# Altium project PCB_Project_PowerLord.PrjPcb (part 1 of 2)
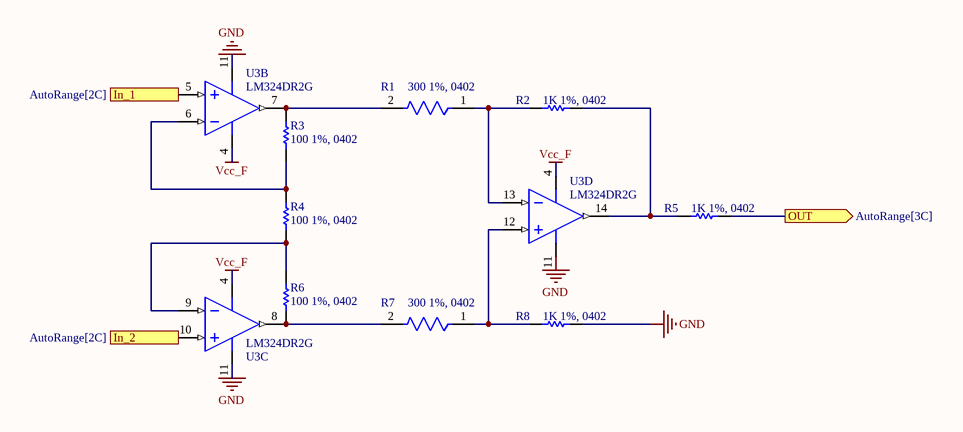
[diagram p0: DiffAmp_K-10.SchDoc]
11 sheets, 126 parts. Net scope: hierarchical (ports join the sheet entries above them; power ports are global).
Board file: PowerModule.PcbDoc
Sheets:
  DiffAmp_K-10.SchDoc
  PowerModule.SchDoc
    PowerModuleCell_M1 = PowerModuleCell.SchDoc
      Temp = TempSensor.SchDoc
  CellVoltageControl.SchDoc
    SellSensor = DiffAmp_K-0.2.SchDoc
  MainBoard.SchDoc
    CurrentSence = MainShunt.SchDoc
    Voltmetr = WideRangeVoltmeter.SchDoc
  UI.SchDoc
  Componets.SchDoc

## Sheet DiffAmp_K-10.SchDoc
size A4; SheetNumber: 5; SheetTotal: 7

### Parts
(Parts that share a designator on the sheet are numbered #1, #2 ... from top to bottom, then left to right.)
R1#1  300 1%, 0402  [FP-ERJ2RK-IPC_A]
R2#1  1K 1%, 0402  [RESC1005X40X25NL05T05]
R3#1  100 1%, 0402  [RESC1005X40X25LL05T05]
R4#1  100 1%, 0402  [RESC1005X40X25LL05T05]
R5#1  1K 1%, 0402  [RESC1005X40X25NL05T05]
R6#1  100 1%, 0402  [RESC1005X40X25LL05T05]
R7#1  300 1%, 0402  [FP-ERJ2RK-IPC_A]
R8#1  1K 1%, 0402  [RESC1005X40X25NL05T05]
U3  LM324DR2G  [ONSC-SOIC-14-751A-03_V]  (parts B,C,D of 4)

### Ports
In_1 (in, see AutoRange[2C]), In_2 (in, see AutoRange[2C]), OUT (out, see AutoRange[3C])

### Nets
GND: R8#1.2 U3.11(VEE/GND)  [project net Shunt_L]
Vcc_F: U3.4(VCC)
NetR1#1_1: R1#1.1 R2#1.1 U3.13(IN4-)
NetR1#1_2: R1#1.2 R3#1.2 U3.7(OUT2)
NetR2#1_2: R2#1.2 R5#1.1 U3.14(OUT4)
NetR3#1_1: R3#1.1 R4#1.2 U3.6(IN2-)
NetR4#1_1: R4#1.1 R6#1.2 U3.9(IN3-)
NetR5#1_2: R5#1.2 ; port OUT
NetR6#1_1: R6#1.1 R7#1.2 U3.8(OUT3)
NetR7#1_1: R7#1.1 R8#1.1 U3.12(IN4+)
NetU3_5: U3.5(IN2+) ; port In_1
NetU3_10: U3.10(IN3+) ; port In_2

### Notes on the sheet
- Labels drawn without touching a wire or pin: GND

### Library data of the parts
R1#1 R7#1 = CMP-1011-00449-3: RES SMD 300 OHM 1% 1/10W 0402; Power Rating: 100mW; Voltage Rating: 50V; Temperature Coefficient: 100ppm/°C; Resistance: 300R; Case Code (Imperial): 0402; Termination: SMD/SMT; REACH SVHC: No SVHC; Number of Terminations: 2; Composition: Thick Film; Case Code (Metric): 1005; Voltage Rating (DC): 50V; Packaging: Tape and Reel; Max Power Dissipation: 100mW; Tolerance: 1%; Lead Free: Lead Free; Military Standard: Not; Mount: Surface Mount; Height: 0.35mm; Package Quantity: 10000; Max Operating Temperature: 155°C; Depth: 0.5mm; Min Operating Temperature: -55°C; Length: 1mm; Contact Plating: Tin; Width: 0.02inch; Case/Package: 0402
R2#1 R5#1 R8#1 = CMP-1011-00510-4: Chip Resistor, 1 KOhm, +/- 1%, 100 mW, -55 to 155 degC, 0402 (1005 Metric), RoHS, Tape and Reel; PartNumber: ERJ-2RKF1001X; Manufacturer: Basic Passives; Voltage Rating: 50 V; Case\/Package: 0402; Resistance: 1 KOhm; Power Rating: 100 mW; DatasheetVersion: 04/2015; Radiation Hardening: No; Pins: 2; Height: 0.35 mm; RoHSCompliant: true; Case Code (Imperial): 0402; ComponentLink2Description: Datasheet; ComponentLink1Description: Manufacturer URL; PackageReference: 0402; Mount: Surface Mount; Package Quantity: 10000; Tolerance: 1%; ComponentLink1URL: http://www.panasonic.com/; PackageDescription: 2-Pin Surface Mount Device, Body 1 x 0.5 mm; Mounting Technology: Surface Mount; Case Code (Metric): 1005; ComponentLink2URL: http://industrial.panasonic.com/cdbs/www-data/pdf/RDA0000/AOA0000C86.pdf; REACH SVHC: Yes; Packaging: Tape and Reel; Max Operating Temperature: 155 degC; Min Operating Temperature: -55 degC; Width: 0.5 mm; Length: 1 mm
R3#1 R4#1 R6#1 = CMP-2002-00605-3: Chip Resistor, 100 Ohm, +/- 1%, 100 mW, -55 to 155 degC, 0402 (1005 Metric), RoHS, Tape and Reel; Manufacturer: Basic Passives; PartNumber: ERJ-2RKF1000X; Power Rating: 100 mW; Resistance: 100 Ohm; Voltage Rating: 50 V; Case\/Package: 0402; Width: 0.5 mm; Pins: 2; ComponentLink2Description: Datasheet; PackageReference: 0402; Height: 0.35 mm; Tolerance: 1%; DatasheetVersion: 04/2015; Case Code (Imperial): 0402; Min Operating Temperature: -55 degC; Radiation Hardening: No; Length: 1 mm; Package Quantity: 10000; PackageDescription: 2-Pin Surface Mount Device, Body 1 x 0.5 mm; Mounting Technology: Surface Mount; Case Code (Metric): 1005; Packaging: Tape and Reel; ComponentLink1URL: http://www.panasonic.com/; RoHSCompliant: true; Max Operating Temperature: 155 degC; REACH SVHC: Yes; ComponentLink1Description: Manufacturer URL; ComponentLink2URL: http://industrial.panasonic.com/cdbs/www-data/pdf/RDA0000/AOA0000C86.pdf; Mount: Surface Mount
U3 = CMP-1310-00171-1: Single Supply Quad Operational Amplifier, 3 to 32 V, 0 to 70 degC, 14-Pin SOIC, Pb-Free, Tape and Reel; Manufacturer: On Semiconductor; VCC Max (V): 32; VCC Min (V): 3; PackageVersion: Rev. K, 05/2011; ComponentLink3URL: http://www.onsemi.com/pub_link/Collateral/751A-03.PDF; ComponentLink3Description: Package Specification; Packing: Tape and Reel; ComponentLink2URL: http://www.onsemi.cn/pub_link/Collateral/LM324-D.PDF; PackageReference: SOIC-14-751A-03; ComponentLink1URL: http://www.onsemi.com/; PackageDescription: 14-Pin Small Outline Integrated Circuit, Body 8.65 x 3.9 mm, Pitch 1.27 mm; ComponentLink1Description: Manufacturer URL; DatasheetVersion: Rev. 25; Mounting Technology: Surface Mount; RoHS: TRUE; ComponentLink2Description: Datasheet; PartNumber: LM324DR2G

## Sheet PowerModule.SchDoc
size A3; SheetNumber: 1; SheetTotal: 4
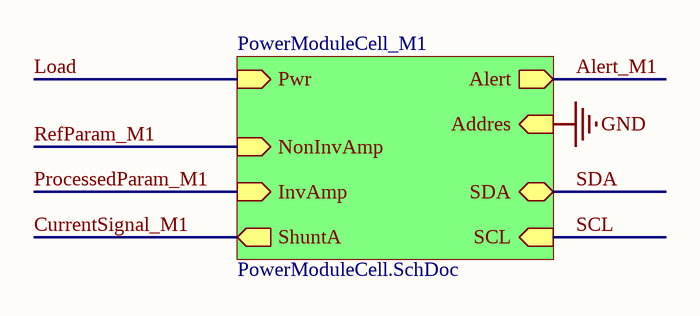
[diagram p1: PowerModule.SchDoc]

### Sub-sheets
PowerModuleCell_M1 = PowerModuleCell.SchDoc: Alert (out), Addres (in), SDA (bidir), SCL (in), Pwr (in), NonInvAmp (in), InvAmp (in), ShuntA (out)

### Nets
Alert_M1: sheet PowerModuleCell_M1/Alert

## Sheet PowerModuleCell.SchDoc
size A4; SheetNumber: 1; SheetTotal: 11
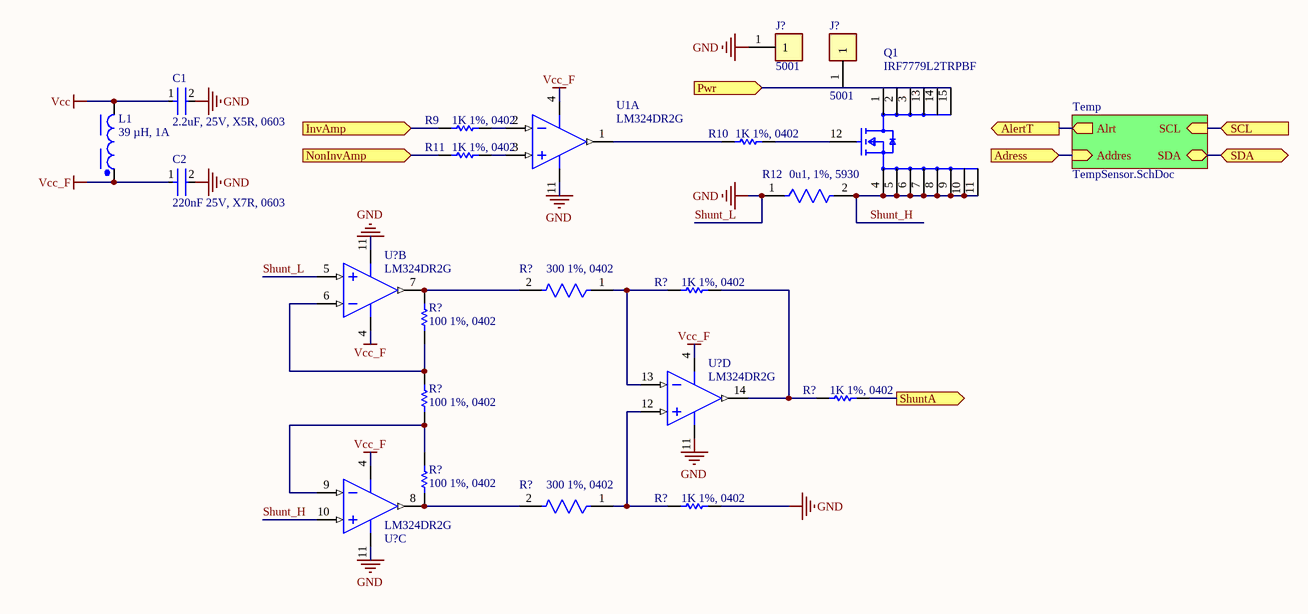
[diagram p2: PowerModuleCell.SchDoc]

### Parts
(Parts that share a designator on the sheet are numbered #1, #2 ... from top to bottom, then left to right.)
C1#1  2.2uF, 25V, X5R, 0603  [FP-GRM188-0_1-e0_2_0_5-MFG]
C2#1  220nF 25V, X7R, 0603  [FP-GCM188-0_1-IPC_B]
J?#1  5001  [FP-5001-MFG]  (no BOM)
J?#2  5001  [FP-5001-MFG]  (no BOM)
L1#1  39 µH, 1A  [WE-PD_7345]
Q1#1  IRF7779L2TRPBF  [FP-MG-WDSON-11-MFG]
R9#1  1K 1%, 0402  [RESC1005X40X25NL05T05]
R10#1  1K 1%, 0402  [RESC1005X40X25NL05T05]
R11#1  1K 1%, 0402  [RESC1005X40X25NL05T05]
R12#1  0u1, 1%, 5930  [FP-CSS2H-5930K-1L00F-MFG]
R?#1  300 1%, 0402  [FP-ERJ2RK-IPC_A]
R?#2  1K 1%, 0402  [RESC1005X40X25NL05T05]
R?#3  100 1%, 0402  [RESC1005X40X25LL05T05]
R?#4  1K 1%, 0402  [RESC1005X40X25NL05T05]
R?#5  100 1%, 0402  [RESC1005X40X25LL05T05]
R?#6  100 1%, 0402  [RESC1005X40X25LL05T05]
R?#7  300 1%, 0402  [FP-ERJ2RK-IPC_A]
R?#8  1K 1%, 0402  [RESC1005X40X25NL05T05]
U1#1  LM324DR2G  [ONSC-SOIC-14-751A-03_V]  (part A of 4)
U?#1  LM324DR2G  [ONSC-SOIC-14-751A-03_V]  (part B of 4)
U?#2  LM324DR2G  [ONSC-SOIC-14-751A-03_V]  (part D of 4)
U?#3  LM324DR2G  [ONSC-SOIC-14-751A-03_V]  (part C of 4)

### Sub-sheets
Temp = TempSensor.SchDoc: Alrt (out), SDA (bidir), SCL (in), Addres (in)

### Ports
Adress (in), AlertT (out), InvAmp (in, see PowerModule[5A]), NonInvAmp (in, see PowerModule[5A]), Pwr (in, see PowerModule[5A]), SCL (in, see PowerModule[6A], TempSensor[3C]), SDA (bidir, see PowerModule[6A], TempSensor[3C]), ShuntA (out, see PowerModule[5A])

### Nets
Shunt_L: C1#1.2 C2#1.2 J?#1.1 R12#1.1 R?#8.2 U1#1.11(VEE/GND) U?#1.5(IN2+) U?#1.11(VEE/GND) U?#3.11(VEE/GND)  [also labelled GND]
Vcc: C1#1.1 L1#1.2
Vcc_F: C2#1.1 L1#1.1 U1#1.4(VCC) U?#1.4(VCC) U?#2.4(VCC) U?#3.4(VCC)
CurrentSignal_M1: R?#4.2 ; port ShuntA
Load: J?#2.1 Q1#1.1(Drain) Q1#1.2(Drain) Q1#1.3(Drain) Q1#1.13(Drain) Q1#1.14(Drain) Q1#1.15(Drain) ; port Pwr
ProcessedParam_M1: R9#1.1 ; port InvAmp
RefParam_M1: R11#1.1 ; port NonInvAmp
SCL: port SCL, sheet Temp/SCL
SDA: port SDA, sheet Temp/SDA
Shunt_H: Q1#1.4(Source) Q1#1.5(Source) Q1#1.6(Source) Q1#1.7(Source) Q1#1.8(Source) Q1#1.9(Source) Q1#1.10(Source) Q1#1.11(Source) R12#1.2 U?#3.10(IN3+)
NetQ1#1_12: Q1#1.12(Gate) R10#1.2
NetR9#1_2: R9#1.2 U1#1.2(IN1-)
NetR10#1_1: R10#1.1 U1#1.1(OUT1)
NetR11#1_2: R11#1.2 U1#1.3(IN1+)
NetR15#1_1: port AlertT, sheet Temp/Alrt
NetR?#1_1: R?#1.1 R?#2.1 U?#2.13(IN4-)
NetR?#1_2: R?#1.2 R?#3.2 U?#1.7(OUT2)
NetR?#2_2: R?#2.2 R?#4.1 U?#2.14(OUT4)
NetR?#3_1: R?#3.1 R?#5.2 U?#1.6(IN2-)
NetR?#5_1: R?#5.1 R?#6.2 U?#3.9(IN3-)
NetR?#6_1: R?#6.1 R?#7.2 U?#3.8(OUT3)
NetR?#7_1: R?#7.1 R?#8.1 U?#2.12(IN4+)
NetU2#1_C1: port Adress, sheet Temp/Addres

Not connected (* = marked no-connect by the designer): U?#2 11(VEE/GND)

### Notes on the sheet
- Labels drawn without touching a wire or pin: GND

### Library data of the parts
C1#1 = CMP-2006-02820-2: Chip Multilayer Ceramic Capacitors for General Purpose, 0603, 2.2uF, X5R, 15%, 10%, 25V; Number of Pins: 2; Dielectric: X5R; Tolerance: 10%; Case Code (Imperial): 0603; Thickness: 0.035inch; Case/Package: 0603; Lead Free: Lead Free; Mount: Surface Mount; Material: Ceramic; Depth: 0.8mm; Voltage: 25V; Capacitance: 2.2uF; Min Operating Temperature: -55°C; Package Quantity: 4000; REACH SVHC: No SVHC; Resistor Type: Ceramic; Packaging: Tape and Reel; Case Code (Metric): 1608; Max Operating Temperature: 85°C; Width: 0.8mm; Termination: SMD/SMT; Voltage Rating: 25V; Length: 1.6mm; Voltage Rating (DC): 25V; Height: 0.8mm; Radiation Hardening: No; Weight: 0.000222oz
C2#1 = CMP-2006-02366-2: Ceramic Capacitor for Automotive 220nF  ±10% 25VDC X7R 0603 Paper T/R; Capacitance: 220nF; Mount: Surface Mount; Ratings: AEC-Q200; Case/Package: 0603; Packaging: Tape and Reel; Radiation Hardening: No; Voltage: 25V; Dielectric: X7R; Case Code (Imperial): 0603; Max Operating Temperature: 125°C; Min Operating Temperature: -55°C; Depth: 0.8mm; Termination: SMD/SMT; Package Quantity: 1; Case Code (Metric): 1608; Thickness: 0.035inch; Voltage Rating: 25V; Tolerance: 10%; Voltage Rating (DC): 25V; Height: 0.8mm; Lead Free: Lead Free; Length: 1.6mm; Width: 0.031inch
J?#1 J?#2 = CMP-2000-05181-2: PC TEST POINT MINIATURE BLACK; Body Material: Bronze; Plating: Silver; Inside Diameter: 1.27mm; Hole Diameter: 1.6mm; Number of Ports: 1; Outside Diameter: 2.54mm; Insulation: Insulated; Insulation Material: Nylon; Mount: Through Hole; RoHS Compliant: Yes; Series: THM; Height: 0.3inch; Termination: Through Hole; Material: Nylon; Packaging: Bulk; Contact Material: Bronze; REACH SVHC: No SVHC; Contact Plating: Silver; Orientation: Straight; Lead Free: Lead Free; Package Quantity: 100; Length: 7.62mm; Flammability Rating: UL94 V-0; Number of Contacts: 1; Diameter: 2.54mm; Housing Color: Black; Color: Black
L1#1 = CMP-0227-00153-2: NexarPartId: 29930417; Max DC Current: 1.11A; Shielding: Shielded; Inductance: 39µH; Self Resonant Frequency: 11MHz; DC Resistance (DCR): 145mΩ; Tolerance: 20%; Ambient Temperature Range Low: -40°C; Width: 7.3mm; Length: 7.3mm; Number of Pins: 2; Packaging: Tape & Reel; Height: 4.5mm; Ambient Temperature Range High: 85°C; Max Operating Temperature: 125°C; Depth: 7.3mm; Min Operating Temperature: -40°C; RoHS: Compliant; Current Rating: 1.11A
Q1#1 = CMP-32901-000937-1: MOSFET N-CH 150V 375A DIRECTFET; Drain to Source Resistance: 11mR; Power Dissipation: 125W; Turn-On Delay Time: 16ns; Threshold Voltage: 4V; Input Capacitance: 6.66nF; Turn-Off Delay Time: 36ns; Gate to Source Voltage (Vgs): 20V; Length: 0.36inch; Number of Pins: 11; Min Operating Temperature: -55°C; Halogen Free: Halogen Free; Rds On Max: 11mR; REACH SVHC: No SVHC; Max Operating Temperature: 175°C; Continuous Drain Current (ID): 375A; Max Power Dissipation: 125W; Mount: Surface Mount; Width: 0.28inch; Max Dual Supply Voltage: 150V; Lead Free: Lead Free; Height: 0.02inch; Series: HEXFET®; RoHS Compliant: Yes; Drain to Source Voltage (Vdss): 150V; Packaging: Cut Tape
R9#1 R10#1 R11#1 R?#2 R?#4 R?#8 = CMP-1011-00510-4: as R2#1 on sheet DiffAmp_K-10; DatasheetVersion: 04/2015; Radiation Hardening: No; Pins: 2; Height: 0.35 mm; RoHSCompliant: true; Case Code (Imperial): 0402; ComponentLink2Description: Datasheet; ComponentLink1Description: Manufacturer URL; PackageReference: 0402; Mount: Surface Mount; Package Quantity: 10000; Tolerance: 1%; ComponentLink1URL: http://www.panasonic.com/; PackageDescription: 2-Pin Surface Mount Device, Body 1 x 0.5 mm; Mounting Technology: Surface Mount; Case Code (Metric): 1005; ComponentLink2URL: http://industrial.panasonic.com/cdbs/www-data/pdf/RDA0000/AOA0000C86.pdf; REACH SVHC: Yes; Packaging: Tape and Reel; Max Operating Temperature: 155 degC; Min Operating Temperature: -55 degC; Width: 0.5 mm; Length: 1 mm
R12#1 = CMP-00059-73869598-1: CSS2H-5930K-1L00F Res Metal Strip 5930 0.001 Ohm 1% 9W ±50ppm/C Pad SMD Automotive T/R; Resistance: 1mΩ; Temperature Coefficient: 50ppm/°C; Case Code (Imperial): 5931; Width: 7.747mm; Min Operating Temperature: -55°C; Tolerance: 1%; Max Power Dissipation: 9W; Case Code (Metric): 1577; Max Operating Temperature: 170°C; NexarPartId: 73869598; Power Rating: 9W; Composition: Metal Element; Case/Package: 5930; Height: 939.8µm; Number of Terminations: 2; Schedule B: 8533210045, 8533210045; Packaging: Cut Tape; REACH SVHC: No SVHC; Features: Moisture Resistant; RoHS: Compliant; Length: 15.0114mm
R?#1 R?#7 = CMP-1011-00449-3: as R1#1 on sheet DiffAmp_K-10; Case Code (Imperial): 0402; Termination: SMD/SMT; REACH SVHC: No SVHC; Number of Terminations: 2; Composition: Thick Film; Case Code (Metric): 1005; Voltage Rating (DC): 50V; Packaging: Tape and Reel; Max Power Dissipation: 100mW; Tolerance: 1%; Lead Free: Lead Free; Military Standard: Not; Mount: Surface Mount; Height: 0.35mm; Package Quantity: 10000; Max Operating Temperature: 155°C; Depth: 0.5mm; Min Operating Temperature: -55°C; Length: 1mm; Contact Plating: Tin; Width: 0.02inch; Case/Package: 0402
R?#3 R?#5 R?#6 = CMP-2002-00605-3: as R3#1 on sheet DiffAmp_K-10; Width: 0.5 mm; Pins: 2; ComponentLink2Description: Datasheet; PackageReference: 0402; Height: 0.35 mm; Tolerance: 1%; DatasheetVersion: 04/2015; Case Code (Imperial): 0402; Min Operating Temperature: -55 degC; Radiation Hardening: No; Length: 1 mm; Package Quantity: 10000; PackageDescription: 2-Pin Surface Mount Device, Body 1 x 0.5 mm; Mounting Technology: Surface Mount; Case Code (Metric): 1005; Packaging: Tape and Reel; ComponentLink1URL: http://www.panasonic.com/; RoHSCompliant: true; Max Operating Temperature: 155 degC; REACH SVHC: Yes; ComponentLink1Description: Manufacturer URL; ComponentLink2URL: http://industrial.panasonic.com/cdbs/www-data/pdf/RDA0000/AOA0000C86.pdf; Mount: Surface Mount
U1#1 U?#1-U?#3 = CMP-1310-00171-1: as U3 on sheet DiffAmp_K-10; PackageVersion: Rev. K, 05/2011; ComponentLink3URL: http://www.onsemi.com/pub_link/Collateral/751A-03.PDF; ComponentLink3Description: Package Specification; Packing: Tape and Reel; ComponentLink2URL: http://www.onsemi.cn/pub_link/Collateral/LM324-D.PDF; PackageReference: SOIC-14-751A-03; ComponentLink1URL: http://www.onsemi.com/; PackageDescription: 14-Pin Small Outline Integrated Circuit, Body 8.65 x 3.9 mm, Pitch 1.27 mm; ComponentLink1Description: Manufacturer URL; DatasheetVersion: Rev. 25; Mounting Technology: Surface Mount; RoHS: TRUE; ComponentLink2Description: Datasheet; PartNumber: LM324DR2G

## Sheet TempSensor.SchDoc
size A4; SheetNumber: 3; SheetTotal: 10
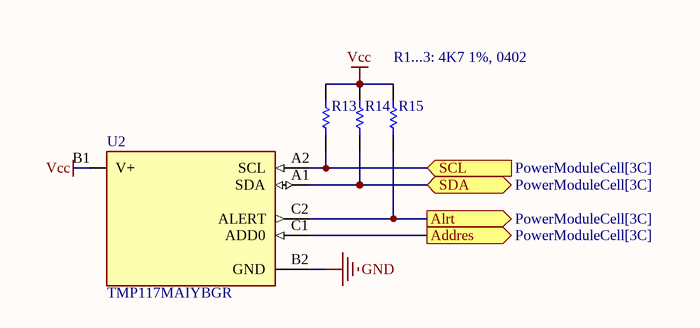
[diagram p3: TempSensor.SchDoc]

### Parts
(Parts that share a designator on the sheet are numbered #1, #2 ... from top to bottom, then left to right.)
R13#1  4K7 1%, 0402  [RESC1005X40X25LL05T05]  (value not drawn)
R14#1  4K7 1%, 0402  [RESC1005X40X25LL05T05]  (value not drawn)
R15#1  4K7 1%, 0402  [RESC1005X40X25LL05T05]  (value not drawn)
U2#1  TMP117MAIYBGR  [FP-YBG0006-MFG]

### Ports
Addres (out, see PowerModuleCell[3C]), Alrt (out, see PowerModuleCell[3C]), SCL (in, see PowerModuleCell[3C]), SDA (bidir, see PowerModuleCell[3C])

### Nets
GND: U2#1.B2(GND)  [project net Shunt_L]
Vcc: R13#1.2 R14#1.2 R15#1.2 U2#1.B1(V+)
SCL: R13#1.1 U2#1.A2(SCL) ; port SCL
SDA: R14#1.1 U2#1.A1(SDA) ; port SDA
NetR15#1_1: R15#1.1 U2#1.C2(ALERT) ; port Alrt
NetU2#1_C1: U2#1.C1(ADD0) ; port Addres

### Notes on the sheet
- R1...3: 4K7 1%, 0402

### Library data of the parts
R13#1 R14#1 R15#1 = CMP-2002-01154-4: Chip Resistor, 4.7 KOhm, +/- 1%, 0.1 W, -55 to 155 degC, 0402 (1005 Metric), RoHS, Tape and Reel; PartNumber: ERJ-2RKF4701X; Voltage Rating: 50 V; Case\/Package: 0402; Power Rating: 100 mW; Height: 0.35 mm; Mounting Technology: Surface Mount; REACH SVHC: Yes; Resistance: 4.7 KOhm; Max Operating Temperature: 155 degC; ComponentLink1Description: Manufacturer URL; ComponentLink2Description: Datasheet; Pins: 2; PackageReference: 0402; Tolerance: 1%; Case Code (Imperial): 0402; Length: 1 mm; PackageDescription: 2-Pin Surface Mount Device, Body 1 x 0.5 mm; RoHSCompliant: true; Package Quantity: 1; Radiation Hardening: No; DatasheetVersion: 04/2015; Width: 0.5 mm; Case Code (Metric): 1005; Mount: Surface Mount; ComponentLink1URL: http://www.panasonic.com/; Min Operating Temperature: -55 degC; Packaging: Cut Tape; ComponentLink2URL: http://industrial.panasonic.com/cdbs/www-data/pdf/RDA0000/AOA0000C86.pdf
U2#1 = CMP-04948-000037-1: TEMP SENSOR

## Sheet CellVoltageControl.SchDoc
size A4; SheetNumber: 1; SheetTotal: 7
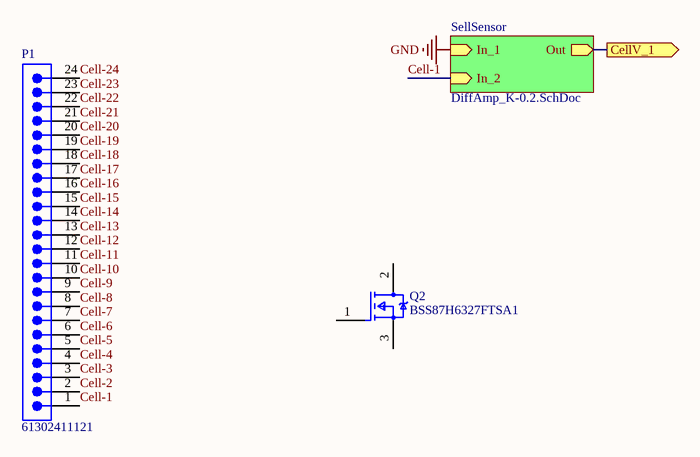
[diagram p4: CellVoltageControl.SchDoc]

### Parts
P1  61302411121  [61302411121]
Q2  BSS87H6327FTSA1  [FP-PG-SOT89-4-MFG]

### Sub-sheets
SellSensor = DiffAmp_K-0.2.SchDoc: Out (out), In_2 (in), In_1 (in)

### Ports
CellV_1 (out)

### Nets
Cell-1: P1.1 ; sheet SellSensor/In_2
Cell-2: P1.2
Cell-3: P1.3
Cell-4: P1.4
Cell-5: P1.5
Cell-6: P1.6
Cell-7: P1.7
Cell-8: P1.8
Cell-9: P1.9
Cell-10: P1.10
Cell-11: P1.11
Cell-12: P1.12
Cell-13: P1.13
Cell-14: P1.14
Cell-15: P1.15
Cell-16: P1.16
Cell-17: P1.17
Cell-18: P1.18
Cell-19: P1.19
Cell-20: P1.20
Cell-21: P1.21
Cell-22: P1.22
Cell-23: P1.23
Cell-24: P1.24
NetR30_2: port CellV_1, sheet SellSensor/Out

Not connected (* = marked no-connect by the designer): Q2 1(Gate) 2(Drain) 3(Source)

### Library data of the parts
P1 = CMP-1502-01109-3: NexarPartId: 32855561; Pitch: 2.54mm; Contact Resistance: 20mΩ; Operating Supply Voltage: 250V; Current Rating: 3A; Gender: Male; Connector Type: Male Pin; Number of Positions: 24; Packaging: Bulk; Lead Pitch: 2.54mm; Number of Pins: 24; Orientation: Vertical; Contact Material: Copper; REACH SVHC: Unknown; Color: Black; Mount: Through Hole; Contact Plating: Gold; Contact Mating Length: 5.9944mm; RoHS: Compliant; Termination: Solder; Number of Rows: 1; Number of Contacts: 24
Q2 = CMP-32901-001322-1: MOSFET N-CH 240V 260MA SOT89-4; Input Capacitance: 97pF; Drain to Source Resistance: 3.9R; Rise Time: 3.5ns; Rds On Max: 6R; Fall Time: 27.3ns; Turn-On Delay Time: 3.7ns; Number of Elements: 1; Power Dissipation: 1W; Element Configuration: Single; Gate to Source Voltage (Vgs): 20V; Polarity: N-CHANNEL; Turn-Off Delay Time: 17.6ns; Case/Package: SOT-89; Max Dual Supply Voltage: 240V; Drain to Source Voltage (Vdss): 240V; Lead Free: Lead Free; Package Quantity: 1000; Halogen Free: Not Halogen Free; RoHS Compliant: Yes; Width: 2.5mm; Length: 4.5mm; Mount: Surface Mount; Packaging: Tape and Reel; Max Power Dissipation: 1W; Height: 1.5mm; Max Operating Temperature: 150°C; Series: SIPMOS®; Drain to Source Breakdown Voltage: 240V; Min Operating Temperature: -55°C; Number of Pins: 3; Continuous Drain Current (ID): 260mA

## Sheet DiffAmp_K-0.2.SchDoc
size A3; SheetNumber: 3; SheetTotal: 7
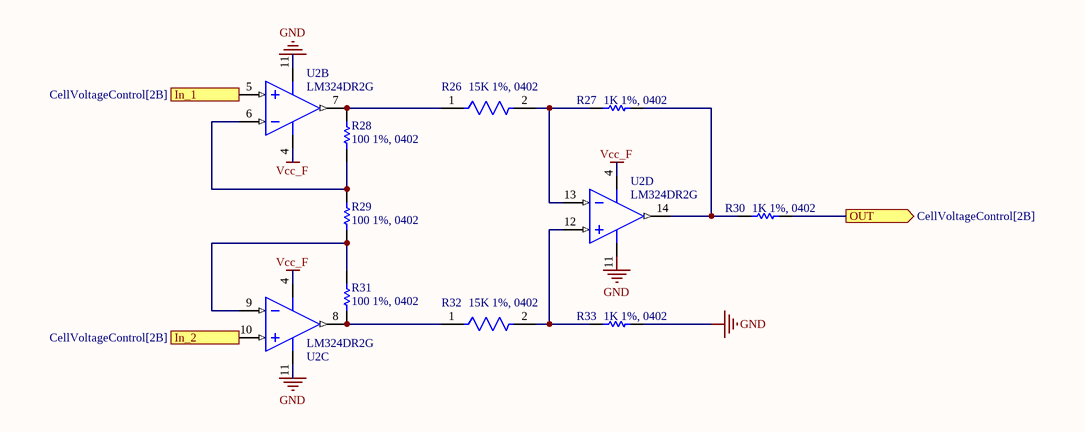
[diagram p5: DiffAmp_K-0.2.SchDoc]

### Parts
(Parts that share a designator on the sheet are numbered #1, #2 ... from top to bottom, then left to right.)
R26  15K 1%, 0402  [FP-ERJ2R-MFG]
R27  1K 1%, 0402  [RESC1005X40X25NL05T05]
R28  100 1%, 0402  [RESC1005X40X25LL05T05]
R29  100 1%, 0402  [RESC1005X40X25LL05T05]
R30  1K 1%, 0402  [RESC1005X40X25NL05T05]
R31  100 1%, 0402  [RESC1005X40X25LL05T05]
R32  15K 1%, 0402  [FP-ERJ2R-MFG]
R33  1K 1%, 0402  [RESC1005X40X25NL05T05]
U2#2  LM324DR2G  [ONSC-SOIC-14-751A-03_V]  (parts B,C,D of 4)

### Ports
In_1 (in, see CellVoltageControl[2B]), In_2 (in, see CellVoltageControl[2B]), OUT (out, see CellVoltageControl[2B])

### Nets
GND: R33.2 U2#2.5(IN2+) U2#2.11(VEE/GND) ; port In_1  [project net Shunt_L]
Vcc_F: U2#2.4(VCC)
Cell-1: U2#2.10(IN3+) ; port In_2
NetR26_1: R26.1 R28.2 U2#2.7(OUT2)
NetR26_2: R26.2 R27.1 U2#2.13(IN4-)
NetR27_2: R27.2 R30.1 U2#2.14(OUT4)
NetR28_1: R28.1 R29.2 U2#2.6(IN2-)
NetR29_1: R29.1 R31.2 U2#2.9(IN3-)
NetR30_2: R30.2 ; port OUT
NetR31_1: R31.1 R32.1 U2#2.8(OUT3)
NetR32_2: R32.2 R33.1 U2#2.12(IN4+)

### Notes on the sheet
- Labels drawn without touching a wire or pin: GND

### Library data of the parts
R26 R32 = CMP-2002-00694-4: RES SMD 15K OHM 1% 1/10W 0402; Manufacturer Part Number: ERJ-2RKF1502X; Manufacturer: Panasonic; Automotive Grade: Grade 0; Voltage Rating: 50V; Resistance: 15kΩ; Temperature Coefficient: 100ppm/°C; Power Rating: 0.1W; Value: 15kΩ; ComponentLink2URL: https://industrial.panasonic.com/cdbs/www-data/pdf/RDA0000/AOA0000C304.pdf; Automotive: Yes; Temperature: -55°C to +155°C; Height: 0.4mm; Digikey Description: RES SMD 15K OHM 1% 1/10W 0402; Category: Res; Device Class L2: Resistors; Device Class L1: Passive Components; Package: ERJ2R; Temperature Range Low: -55°C; Tolerance: 1%; Series: ERJ; Footprint Url: https://b2b-api.panasonic.eu/file_stream/pids/fileversion/1180; Mouser Description: Res Thick Film 1.0 x 0.5 mm 15K Ohm 1% 0.1W(1/10W) 100ppm/ C Molded SMD Punched Carrier T/R; Composition: Thick Film; Lead Free: Yes; Device Class L3: Chip SMD Resistors; Octopart: https://octopart.com/erj-2rkf1502x-panasonic-55404985; RoHS: TRUE; Temperature Range High: +155°C; ComponentLink2Description: Datasheet
R27 R30 R33 = CMP-1011-00510-4: as R2#1 on sheet DiffAmp_K-10; DatasheetVersion: 04/2015; Radiation Hardening: No; Pins: 2; Height: 0.35 mm; RoHSCompliant: true; Case Code (Imperial): 0402; ComponentLink2Description: Datasheet; ComponentLink1Description: Manufacturer URL; PackageReference: 0402; Mount: Surface Mount; Package Quantity: 10000; Tolerance: 1%; ComponentLink1URL: http://www.panasonic.com/; PackageDescription: 2-Pin Surface Mount Device, Body 1 x 0.5 mm; Mounting Technology: Surface Mount; Case Code (Metric): 1005; ComponentLink2URL: http://industrial.panasonic.com/cdbs/www-data/pdf/RDA0000/AOA0000C86.pdf; REACH SVHC: Yes; Packaging: Tape and Reel; Max Operating Temperature: 155 degC; Min Operating Temperature: -55 degC; Width: 0.5 mm; Length: 1 mm
R28 R29 R31 = CMP-2002-00605-3: as R3#1 on sheet DiffAmp_K-10; Width: 0.5 mm; Pins: 2; ComponentLink2Description: Datasheet; PackageReference: 0402; Height: 0.35 mm; Tolerance: 1%; DatasheetVersion: 04/2015; Case Code (Imperial): 0402; Min Operating Temperature: -55 degC; Radiation Hardening: No; Length: 1 mm; Package Quantity: 10000; PackageDescription: 2-Pin Surface Mount Device, Body 1 x 0.5 mm; Mounting Technology: Surface Mount; Case Code (Metric): 1005; Packaging: Tape and Reel; ComponentLink1URL: http://www.panasonic.com/; RoHSCompliant: true; Max Operating Temperature: 155 degC; REACH SVHC: Yes; ComponentLink1Description: Manufacturer URL; ComponentLink2URL: http://industrial.panasonic.com/cdbs/www-data/pdf/RDA0000/AOA0000C86.pdf; Mount: Surface Mount
U2#2 = CMP-1310-00171-1: as U3 on sheet DiffAmp_K-10; PackageVersion: Rev. K, 05/2011; ComponentLink3URL: http://www.onsemi.com/pub_link/Collateral/751A-03.PDF; ComponentLink3Description: Package Specification; Packing: Tape and Reel; ComponentLink2URL: http://www.onsemi.cn/pub_link/Collateral/LM324-D.PDF; PackageReference: SOIC-14-751A-03; ComponentLink1URL: http://www.onsemi.com/; PackageDescription: 14-Pin Small Outline Integrated Circuit, Body 8.65 x 3.9 mm, Pitch 1.27 mm; ComponentLink1Description: Manufacturer URL; DatasheetVersion: Rev. 25; Mounting Technology: Surface Mount; RoHS: TRUE; ComponentLink2Description: Datasheet; PartNumber: LM324DR2G

## Sheet MainBoard.SchDoc
size A3; SheetNumber: 6; SheetTotal: 7
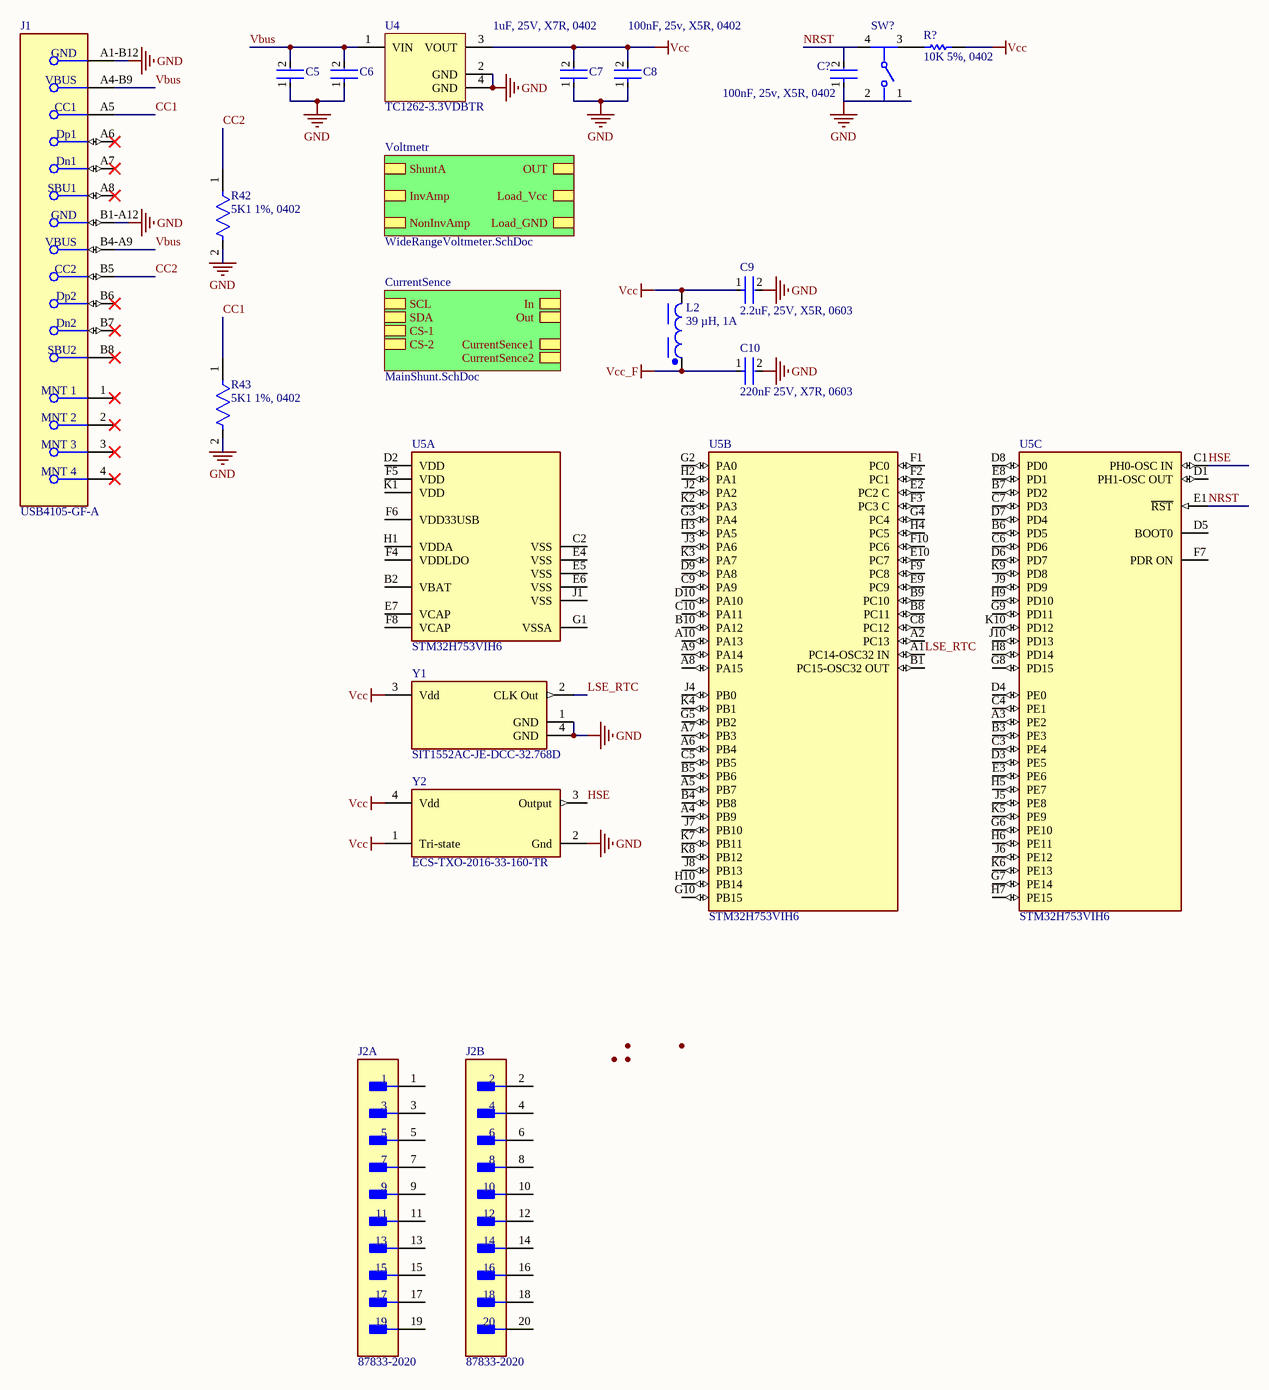
[diagram p6: MainBoard.SchDoc]

### Parts
(Parts that share a designator on the sheet are numbered #1, #2 ... from top to bottom, then left to right.)
C5  1uF, 25V, X7R, 0402  [FP-GRM155-0_05-IPC_B]  (value not drawn)
C6  100nF, 25v, X5R, 0402  [FP-GRM155-0_05-IPC_C]  (value not drawn)
C7  100nF, 25v, X5R, 0402  [FP-GRM155-0_05-IPC_C]  (value not drawn)
C8  1uF, 25V, X7R, 0402  [FP-GRM155-0_05-IPC_B]  (value not drawn)
C9  2.2uF, 25V, X5R, 0603  [FP-GRM188-0_1-e0_2_0_5-MFG]
C10  220nF 25V, X7R, 0603  [FP-GCM188-0_1-IPC_B]
C?  100nF, 25v, X5R, 0402  [FP-GRM155-0_05-IPC_C]
J1  USB4105-GF-A  [FP-USB4105-GF-A-MFG]
J2  87833-2020  [FP-87833-2020-MFG]  (parts A,B of 2)
L2  39 µH, 1A  [WE-PD_7345]
R42  5K1 1%, 0402  [FP-ERJ2RK-IPC_A]
R43  5K1 1%, 0402  [FP-ERJ2RK-IPC_A]
R?#9  10K 5%, 0402  [RESC1005X40X25ML05T05]
SW?#1  PTS645SM43SMTR92LFS  [FP-PTS645SM43SMTR92LFS-MFG]  (value not drawn)
U4  TC1262-3.3VDBTR  [SOT-223-DB3_M]
U5  STM32H753VIH6  [FP-TFBGA100-A08Q-MFG]  (parts A,B,C of 3)
Y1  SIT1552AC-JE-DCC-32.768D  [FP-SiT1552-J-MFG]
Y2  ECS-TXO-2016-33-160-TR  [FP-TXO-2016-MFG]

### Sub-sheets
CurrentSence = MainShunt.SchDoc: CurrentSence1, CurrentSence2, CS-1, CS-2, SDA, SCL, In, Out
Voltmetr = WideRangeVoltmeter.SchDoc: InvAmp, NonInvAmp, Load_GND, Load_Vcc, ShuntA, OUT

### Nets
GND: C5.1 C6.1 C7.1 C8.1 C9.2 C10.2 C?.1 J1.A1-B12(GND) J1.B1-A12(GND) R42.2 R43.2 SW?#1.1 SW?#1.2 U4.2(GND) U4.4(GND) Y1.1(GND) Y1.4(GND) Y2.2(Gnd)  [project net Shunt_L]
Vcc: C7.2 C8.2 C9.1 L2.2 R?#9.1 U4.3(VOUT) Y1.3(Vdd) Y2.1(Tri-state) Y2.4(Vdd)
Vcc_F: C10.1 L2.1
CC1: J1.A5(CC1) R43.1
CC2: J1.B5(CC2) R42.1
HSE: U5.C1(PH0-OSC_IN) Y2.3(Output)
LSE_RTC: U5.A1(PC14-OSC32_IN) Y1.2(CLK_Out)
NRST: C?.2 SW?#1.4 U5.E1(~{RST})
Vbus: C5.2 C6.2 J1.A4-B9(VBUS) J1.B4-A9(VBUS) U4.1(VIN)
NetR?#9_2: R?#9.2 SW?#1.3

Not connected (* = marked no-connect by the designer): J1 1(MNT_1)* 2(MNT_2)* 3(MNT_3)* 4(MNT_4)* A6(Dp1)* A7(Dn1)* A8(SBU1)* B6(Dp2)* B7(Dn2)* B8(SBU2)*; J2 1 2 3 4 5 6 7 8 9 10 11 12 13 14 15 16 17 18 19 20; U5 A2(PC13) A3(PE2) A4(PB9) A5(PB7) A6(PB4) A7(PB3) A8(PA15) A9(PA14) A10(PA13) B1(PC15-OSC32_OUT) B2(VBAT) B3(PE3) B4(PB8) B5(PB6) B6(PD5) B7(PD2) B8(PC11) B9(PC10) B10(PA12) C2(VSS) C3(PE4) C4(PE1) C5(PB5) C6(PD6) C7(PD3) C8(PC12) C9(PA9) C10(PA11) D1(PH1-OSC_OUT) D2(VDD) D3(PE5) D4(PE0) D5(BOOT0) D6(PD7) D7(PD4) D8(PD0) D9(PA8) D10(PA10) E2(PC2_C) E3(PE6) E4(VSS) E5(VSS) E6(VSS) E7(VCAP) E8(PD1) E9(PC9) E10(PC7) F1(PC0) F2(PC1) F3(PC3_C) F4(VDDLDO) F5(VDD) F6(VDD33USB) F7(PDR_ON) F8(VCAP) F9(PC8) F10(PC6) G1(VSSA) G2(PA0) G3(PA4) G4(PC4) G5(PB2) G6(PE10) G7(PE14) G8(PD15) G9(PD11) G10(PB15) H1(VDDA) H2(PA1) H3(PA5) H4(PC5) H5(PE7) H6(PE11) H7(PE15) H8(PD14) H9(PD10) H10(PB14) J1(VSS) J2(PA2) J3(PA6) J4(PB0) J5(PE8) J6(PE12) J7(PB10) J8(PB13) J9(PD9) J10(PD13) K1(VDD) K2(PA3) K3(PA7) K4(PB1) K5(PE9) K6(PE13) K7(PB11) K8(PB12) K9(PD8) K10(PD12)

### Notes on the sheet
- 1uF, 25V, X7R, 0402
- (near C8) 100nF, 25v, X5R, 0402

### Library data of the parts
C5 C8 = CMP-2008-04581-2: Chip Multilayer Ceramic Capacitors for General Purpose, 0402, 1.0uF, X5R, 15%, 10%, 25V; Height: 0.5mm; Voltage: 25V; Tolerance: 10%; Termination: SMD/SMT; Dielectric: X5R; REACH SVHC: No SVHC; Case Code (Imperial): 0402; Max Operating Temperature: 85°C; Lead Free: Lead Free; Case/Package: 0402; Mount: Surface Mount; Width: 0.5mm; Weight: 0.000212oz; Min Operating Temperature: -55°C; Voltage Rating (DC): 25V; Length: 1mm; Thickness: 0.022inch; Voltage Rating: 25V; Material: Ceramic; Case Code (Metric): 1005; Package Quantity: 10000; Packaging: Tape and Reel; Depth: 0.5mm; Capacitance: 1uF
C6 C7 C? = CMP-06035-003661-1: Chip Multilayer Ceramic Capacitors for General Purpose, 0402, 0.10uF, X7R, 15%, 10%, 25V; Length: 1mm; Depth: 0.5mm; Dielectric: X7R; Voltage Rating: 25V; Lead Free: Lead Free; Case Code (Imperial): 0402; Voltage: 25V; Min Operating Temperature: -55°C; Tolerance: 10%; Dielectric Material: Ceramic; Voltage Rating (DC): 25V; Max Operating Temperature: 125°C; Capacitance: 100nF; Thickness: 0.022inch; Case/Package: 0402; Height: 0.5mm; Resistor Type: Ceramic; Weight: 0.000212oz; Case Code (Metric): 1005; Package Quantity: 10000; Termination: SMD/SMT; Width: 0.02inch; Mount: Surface Mount; Packaging: Tape and Reel
C9 = CMP-2006-02820-2: as C1#1 on sheet PowerModuleCell; Number of Pins: 2; Dielectric: X5R; Tolerance: 10%; Case Code (Imperial): 0603; Thickness: 0.035inch; Case/Package: 0603; Lead Free: Lead Free; Mount: Surface Mount; Material: Ceramic; Depth: 0.8mm; Voltage: 25V; Capacitance: 2.2uF; Min Operating Temperature: -55°C; Package Quantity: 4000; REACH SVHC: No SVHC; Resistor Type: Ceramic; Packaging: Tape and Reel; Case Code (Metric): 1608; Max Operating Temperature: 85°C; Width: 0.8mm; Termination: SMD/SMT; Voltage Rating: 25V; Length: 1.6mm; Voltage Rating (DC): 25V; Height: 0.8mm; Radiation Hardening: No; Weight: 0.000222oz
C10 = CMP-2006-02366-2: as C2#1 on sheet PowerModuleCell; Capacitance: 220nF; Mount: Surface Mount; Ratings: AEC-Q200; Case/Package: 0603; Packaging: Tape and Reel; Radiation Hardening: No; Voltage: 25V; Dielectric: X7R; Case Code (Imperial): 0603; Max Operating Temperature: 125°C; Min Operating Temperature: -55°C; Depth: 0.8mm; Termination: SMD/SMT; Package Quantity: 1; Case Code (Metric): 1608; Thickness: 0.035inch; Voltage Rating: 25V; Tolerance: 10%; Voltage Rating (DC): 25V; Height: 0.8mm; Lead Free: Lead Free; Length: 1.6mm; Width: 0.031inch
J1 = CMP-245163-000001-1: CONN RCPT USB2.0 TYPEC 5A; Manufacturer: GCT; Voltage Rating: 20V; Is Female: yes; Current Rating: 5/6.25/1.25/0.25A; Number Of Contacts: 16; Conn Orientation: Right Angle; Device Class L1: Connectors; Category: Conn; Lead Free: Yes; RoHS: TRUE; Temperature Range High: +85°C; Digikey Description: CONN RCPT USB2.0 TYPEC 5A; Device Class L3: unset; ComponentLink2Description: Datasheet; Manufacturer Part Number: USB4105-GF-A; Package: 0; Usb Standard: USB 2.0; Device Class L2: USB Connectors; Automotive: No; Temperature Range Low: -40°C; Height: 3.46mm; Temperature: -40°C to +85°C; Contact Material: Gold,Nickel; ComponentLink2URL: https://gct.co/files/drawings/usb4105.pdf; Octopart: https://octopart.com/usb4105-gf-a-gct-106627878
J2 = CMP-00257-00277225-1: 87833-2020 Conn Shrouded Header (4 Sides) HDR 20 POS 2mm Solder RA Side Entry Thru-Hole Milli-Grid™ Tube; NexarPartId: 277225; Shrouded: Yes RoHS Compliant: Yes; Glow Wire Compliant: Non-compliant; Gender: Male; Number of Contacts: 20; Insulation Resistance: 1GΩ; Voltage Rating: 125V; Current Rating: 2A; Number of Rows: 2; Housing Color: Black; Orientation: Right Angle; RoHS: Compliant; Lead Pitch: 2mm; Flammability Rating: UL94 V-0; Contact Gender: Male; Min Operating Temperature: -55°C; Number of Circuits: 20; Max Operating Temperature: 105°C; Lead Free: Lead Free; Color: Black; Housing Material: Thermoplastic; Contact Plating: Gold; Number of Positions: 20; Row Spacing: 2mm; Termination: Solder; Contact Material: Brass; Mount: Through Hole; Height: 6.5mm; Voltage Rating (DC): 125V; Radiation Hardening: No; Pitch: 2mm; Schedule B: 8536694040
L2 = CMP-0227-00153-2: as L1#1 on sheet PowerModuleCell; Ambient Temperature Range Low: -40°C; Width: 7.3mm; Length: 7.3mm; Number of Pins: 2; Packaging: Tape & Reel; Height: 4.5mm; Ambient Temperature Range High: 85°C; Max Operating Temperature: 125°C; Depth: 7.3mm; Min Operating Temperature: -40°C; RoHS: Compliant; Current Rating: 1.11A
R42 R43 = CMP-2002-01158-2: RES SMD 5.1K OHM 1% 1/10W 0402; Voltage Rating: 50V; Temperature Coefficient: 100ppm/°C; Resistance: 5.1kR; Power Rating: 100mW; Min Operating Temperature: -55°C; Technology: THICK FILM; Military Standard: Not; Depth: 0.5mm; Contact Plating: Tin; Tolerance: 1%; Construction: Rectangular; Length: 1mm; Case/Package: 0402; Lead Free: Lead Free; RoHS Compliant: Yes; Termination: SMD/SMT; Height: 0.35mm; Max Operating Temperature: 155°C; Case Code (Imperial): 0402; Number of Terminations: 2; Packaging: Tape and Reel; Case Code (Metric): 1005; Width: 0.5mm; Max Power Dissipation: 100mW; Package Quantity: 10000; Resistance Tolerance: 1%; REACH SVHC: No SVHC; Mount: Surface Mount; Series: ERJ; Voltage Rating (DC): 50V; Weight: 2.8E-05oz; Resistor Type: Thick Film
R?#9 = CMP-2002-00433-1: Part Number: ERJ-2GEJ103X; Manufacturer: Panasonic
SW?#1 = CMP-2000-05160-2: SWITCH TACTILE SPST-NO 0.05A 12V; Contact Resistance: 100mR; Throw Configuration: SPST; Illumination Type: Non-Illuminated; Mechanical Life: 100000Cycles; Current Rating: 50mA; Switch Function: Off-Mom; Actuator Length: 0.85mm; Actuator Material: Nylon; Actuator Type: Standard; Operating Force: 160gf; Min Operating Temperature: -20°C; REACH SVHC: No SVHC; Termination: Gull Wing; Case/Package: SMD/SMT; Packaging: Tape and Reel; Mount: Surface Mount; Voltage Rating (DC): 12V; Orientation: Straight; Lead Free: Lead Free; Contact Material: Silver; Color: Black; Max Current Rating: 50mA; Contact Plating: Silver; Depth: 9mm; Package Quantity: 1; Max Voltage Rating (DC): 12V; Length: 6mm; Max Operating Temperature: 60°C
U4 = CMP-0136-00481-1: 500mA Fixed Output CMOS LDO, 3-Pin SOT-223, Extended Temperature, Tape and Reel; PackageVersion: revBB, Aug-2009; PackageDescription: 3-Lead Plastic Small Outline Transistor (DB) [SOT-223]; DatasheetVersion: revB, 2002; PackageReference: SOT-223-DB3
U5 = CMP-12105-000002-1: HIGH-PERFORMANCE AND DSP WITH DP; Manufacturer: STMicroelectronics; Number Of Timers/Counters: 20; Min Supply Voltage: 1.71V; Standoff Height: 0.15mm; Number Of I/Os: 82; Data Bus Width: 32bits; Interface: I2C,SPI,UART,USART,CAN,USB,Ethernet,I2S,SMBus,Other; Memory Size: 2MBytes; Core Architecture: ARM Cortex-M7; Frequency: 480MHz; Number Of Spi Channels: 6; Memory Type: FLASH; Max Junction Temp: +125°C; Number Of Pwm Channels: 2; Nominal Supply Current: 70-165uA; Number Of A/D Converters: 3; Ram Size: 1MBytes; Number Of I2C Channels: 4; Number Of Adc Channels: 36; Max Supply Voltage: 3.6V; Number Of Cores: 1; Number Of Uart Channels: 9; Automotive: No; Lead Free: Yes; Device Class L3: Microcontrollers; ComponentLink2URL: https://www.st.com/resource/en/datasheet/stm32h753ai.pdf; Temperature: -40°C to +85°C; Device Class L1: Integrated Circuits (ICs); Digikey Description: HIGH-PERFORMANCE AND DSP WITH DP; Ipc Land Pattern Name: BGA100C80P10X10_800X800X110; ComponentLink2Description: Datasheet; Ambient Temperature Range Low: -40°C; Category: IC; Height: 1.1mm; Temperature Range High: +85°C; Ambient Temperature Range High: +85°C; Temperature Range Low: -40°C; Number Of Usb Channels: 2; Manufacturer Part Number: STM32H753VIH6; Octopart: https://octopart.com/stm32h753vih6-stmicroelectronics-93180202; Package: TFBGA100-A08Q; Number Of Ethernet Channels: 1; Device Class L2: Embedded Processors and Controllers; RoHS: TRUE
Y1 = CMP-25159-260295-1: MEMS OSC TCXO 32.7680KHZ LVCMOS; Frequency Stability: 5ppm; Frequency: 32.768kHz; Min Operating Temperature: 0°C; Length: 0.061inch; Mount: Surface Mount; Max Operating Temperature: 70°C; Width: 0.033inch; RoHS Compliant: Yes; Series: SiT1552; Packaging: Cut Tape; Height: 0.024inch
Y2 = CMP-40224-000008-1: XTAL OSC TCXO 16MHZ 3.3V SMD; Manufacturer: ECS; Max Supply Voltage: 3.63V; Max Supply Current: 7mA; Stability: 2ppm; Min Supply Voltage: 2.97V; Load Capacitance: 15pF; Frequency: 16MHz; Device Class L1: Passive Components; Manufacturer Part Number: ECS-TXO-2016-33-160-TR; Digikey Description: XTAL OSC TCXO 16MHZ 3.3V SMD; Device Class L3: Oscillators; Category: Crys; Lead Free: Yes; Temperature: -40°C to +85°C; RoHS: TRUE; ComponentLink2Description: Datasheet; Octopart: https://octopart.com/ecs-txo-2016-33-160-tr-ecs+international-102811109; ComponentLink2URL: https://ecsxtal.com/store/pdf/ECS-TXO-2016.pdf; Temperature Range High: +85°C; Height: 0.8mm; Device Class L2: Crystals / Oscillators; Package: TXO-2016; Temperature Range Low: -40°C; Series: TXO-2016; Automotive: No

## Sheet MainShunt.SchDoc
size A4; SheetNumber: 7; SheetTotal: 7
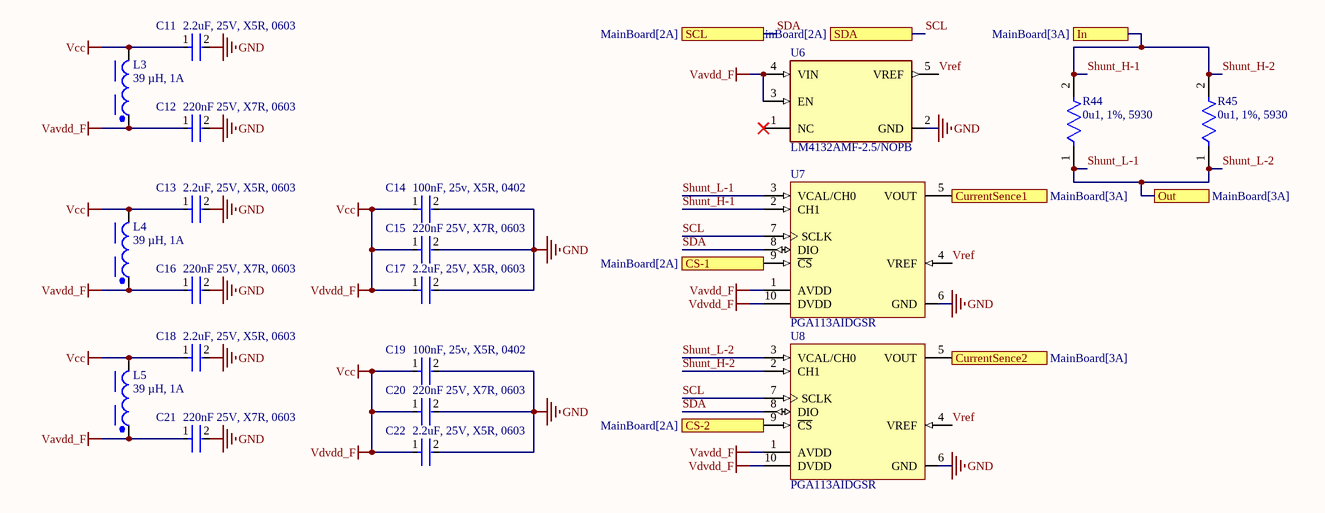
[diagram p7: MainShunt.SchDoc]

### Parts
C11  2.2uF, 25V, X5R, 0603  [FP-GRM188-0_1-e0_2_0_5-MFG]
C12  220nF 25V, X7R, 0603  [FP-GCM188-0_1-IPC_B]
C13  2.2uF, 25V, X5R, 0603  [FP-GRM188-0_1-e0_2_0_5-MFG]
C14  100nF, 25v, X5R, 0402  [FP-GRM155-0_05-IPC_C]
C15  220nF 25V, X7R, 0603  [FP-GCM188-0_1-IPC_B]
C16  220nF 25V, X7R, 0603  [FP-GCM188-0_1-IPC_B]
C17  2.2uF, 25V, X5R, 0603  [FP-GRM188-0_1-e0_2_0_5-MFG]
C18  2.2uF, 25V, X5R, 0603  [FP-GRM188-0_1-e0_2_0_5-MFG]
C19  100nF, 25v, X5R, 0402  [FP-GRM155-0_05-IPC_C]
C20  220nF 25V, X7R, 0603  [FP-GCM188-0_1-IPC_B]
C21  220nF 25V, X7R, 0603  [FP-GCM188-0_1-IPC_B]
C22  2.2uF, 25V, X5R, 0603  [FP-GRM188-0_1-e0_2_0_5-MFG]
L3  39 µH, 1A  [WE-PD_7345]
L4  39 µH, 1A  [WE-PD_7345]
L5  39 µH, 1A  [WE-PD_7345]
R44  0u1, 1%, 5930  [FP-CSS2H-5930K-1L00F-MFG]
R45  0u1, 1%, 5930  [FP-CSS2H-5930K-1L00F-MFG]
U6  LM4132AMF-2.5/NOPB  [FP-DBV0005A-IPC_C]
U7  PGA113AIDGSR  [DGS0010A_L]
U8  PGA113AIDGSR  [DGS0010A_L]

### Ports
CS-1 (see MainBoard[2A]), CS-2 (see MainBoard[2A]), CurrentSence1 (see MainBoard[3A]), CurrentSence2 (see MainBoard[3A]), In (see MainBoard[3A]), Out (see MainBoard[3A]), SCL (see MainBoard[2A]), SDA (see MainBoard[2A])

### Nets
GND: C11.2 C12.2 C13.2 C14.2 C15.2 C16.2 C17.2 C18.2 C19.2 C20.2 C21.2 C22.2 U6.2(GND) U7.6(GND) U8.6(GND)  [project net Shunt_L]
Vavdd_F: C12.1 C16.1 C21.1 L3.1 L4.1 L5.1 U6.3(EN) U6.4(VIN) U7.1(AVDD) U8.1(AVDD)
Vcc: C11.1 C13.1 C14.1 C15.1 C17.1 C18.1 C19.1 C20.1 C22.1 L3.2 L4.2 L5.2 U7.10(DVDD) U8.10(DVDD)  [also labelled Vdvdd_F]
SCL: U7.7(SCLK) U8.7(SCLK) ; port SDA
SDA: U7.8(DIO) U8.8(DIO) ; port SCL
Shunt_H-1: R44.2 R45.2 U7.2(CH1) U8.2(CH1) ; port In  [also labelled Shunt_H-2]
Shunt_L-1: R44.1 R45.1 U7.3(VCAL/CH0) U8.3(VCAL/CH0) ; port Out  [also labelled Shunt_L-2]
Vref: U6.5(VREF) U7.4(VREF) U8.4(VREF)
NetU7_5: U7.5(VOUT) ; port CurrentSence1
NetU7_9: U7.9(~{CS}) ; port CS-1
NetU8_5: U8.5(VOUT) ; port CurrentSence2
NetU8_9: U8.9(~{CS}) ; port CS-2

Not connected (* = marked no-connect by the designer): U6 1(NC)*

### Library data of the parts
C11 C13 C17 C18 C22 = CMP-2006-02820-2: as C1#1 on sheet PowerModuleCell; Number of Pins: 2; Dielectric: X5R; Tolerance: 10%; Case Code (Imperial): 0603; Thickness: 0.035inch; Case/Package: 0603; Lead Free: Lead Free; Mount: Surface Mount; Material: Ceramic; Depth: 0.8mm; Voltage: 25V; Capacitance: 2.2uF; Min Operating Temperature: -55°C; Package Quantity: 4000; REACH SVHC: No SVHC; Resistor Type: Ceramic; Packaging: Tape and Reel; Case Code (Metric): 1608; Max Operating Temperature: 85°C; Width: 0.8mm; Termination: SMD/SMT; Voltage Rating: 25V; Length: 1.6mm; Voltage Rating (DC): 25V; Height: 0.8mm; Radiation Hardening: No; Weight: 0.000222oz
C12 C15 C16 C20 C21 = CMP-2006-02366-2: as C2#1 on sheet PowerModuleCell; Capacitance: 220nF; Mount: Surface Mount; Ratings: AEC-Q200; Case/Package: 0603; Packaging: Tape and Reel; Radiation Hardening: No; Voltage: 25V; Dielectric: X7R; Case Code (Imperial): 0603; Max Operating Temperature: 125°C; Min Operating Temperature: -55°C; Depth: 0.8mm; Termination: SMD/SMT; Package Quantity: 1; Case Code (Metric): 1608; Thickness: 0.035inch; Voltage Rating: 25V; Tolerance: 10%; Voltage Rating (DC): 25V; Height: 0.8mm; Lead Free: Lead Free; Length: 1.6mm; Width: 0.031inch
C14 C19 = CMP-06035-003661-1: as C6 on sheet MainBoard; Length: 1mm; Depth: 0.5mm; Dielectric: X7R; Voltage Rating: 25V; Lead Free: Lead Free; Case Code (Imperial): 0402; Voltage: 25V; Min Operating Temperature: -55°C; Tolerance: 10%; Dielectric Material: Ceramic; Voltage Rating (DC): 25V; Max Operating Temperature: 125°C; Capacitance: 100nF; Thickness: 0.022inch; Case/Package: 0402; Height: 0.5mm; Resistor Type: Ceramic; Weight: 0.000212oz; Case Code (Metric): 1005; Package Quantity: 10000; Termination: SMD/SMT; Width: 0.02inch; Mount: Surface Mount; Packaging: Tape and Reel
L3-L5 = CMP-0227-00153-2: as L1#1 on sheet PowerModuleCell; Ambient Temperature Range Low: -40°C; Width: 7.3mm; Length: 7.3mm; Number of Pins: 2; Packaging: Tape & Reel; Height: 4.5mm; Ambient Temperature Range High: 85°C; Max Operating Temperature: 125°C; Depth: 7.3mm; Min Operating Temperature: -40°C; RoHS: Compliant; Current Rating: 1.11A
R44 R45 = CMP-00059-73869598-1: as R12#1 on sheet PowerModuleCell; Case Code (Imperial): 5931; Width: 7.747mm; Min Operating Temperature: -55°C; Tolerance: 1%; Max Power Dissipation: 9W; Case Code (Metric): 1577; Max Operating Temperature: 170°C; NexarPartId: 73869598; Power Rating: 9W; Composition: Metal Element; Case/Package: 5930; Height: 939.8µm; Number of Terminations: 2; Schedule B: 8533210045, 8533210045; Packaging: Cut Tape; REACH SVHC: No SVHC; Features: Moisture Resistant; RoHS: Compliant; Length: 15.0114mm
U6 = CMP-0074-00531-5: IC VREF SERIES 0.05% SOT23-5; Quiescent Current: 100uA; Output Current: 20mA; Number of Channels: 1; Temperature Coefficient: 20ppm/°C; Max Input Voltage: 6V; Output Voltage: 2.5V; Max Supply Voltage: 2.2V; Dropout Voltage: 175mV; Supply Current: 60uA; Output Type: Fixed; Length: 2.92mm; Radiation Hardening: No; Reference Type: Series; Mount: Surface Mount; Packaging: Tape and Reel; Width: 1.6mm; Max Operating Temperature: 125°C; Lead Free: Lead Free; Series: -; Number of Pins: 5; REACH SVHC: No SVHC; Max Output Voltage: 2.5V; Package Quantity: 1000; Tolerance: 0.05%; Min Input Voltage: 2.2V; Case/Package: SOT-23; Termination: SMD/SMT; Height: 1.02mm; Min Output Voltage: 2.5V; Reference Voltage: 2.5V; Max Output Current: 20mA; Nominal Supply Current: 60uA; Min Operating Temperature: -40°C; Operating Supply Current: 100uA
U7 U8 = CMP-0988-00040-2: Zero-Drift, Programmable Gain Amplifier with MUX, -40 to 125 degC, 10-pin SOP (DGS10), Green (RoHS & no Sb/Br); Manufacturer: Texas Instruments; Vs(Max)(V): 5.5; Vs(Min)(V): 2.2; Slew Rate(Typ)(V/us): 3; Input Offset (+/-)(Max)(uV): 100; Common Mode Input High(Min)(V): AVdd -0.1V; Quiescent Current (+/-)(Typ)(mA): 1; Noise at 1kHz(Typ)(nV/rt(Hz)): 13; Gain Error (+/-)(Max)(%): 0.1; Number of Channels: 2; Input Bias Current (+/-)(Max)(nA): 5; Gain(V/V): 1, 2, 5, 10, 20, 50, 100, 200; Settling Time to 0.01%(Typ)(us): 2.55; Non-Linearity (+/-)(Max)(%): 0.0015; Common Mode Input Low(Min)(V): GND + 0.1V; Input Offset Drift (+/-)(Max)(uV/Degrees Celsius): 1.2; Code_JEDEC: MO-153; SubFamily: Programmable Gain Amplifier; ComponentLink2URL: http://www.ti.com/general/docs/lit/getliterature.tsp?genericPartNumber=PGA113&fileType=pdf; ComponentLink2Description: Datasheet; PackageReference: DGS0010A; ComponentLink3Description: Package Specification; ComponentLink1URL: http://www.ti.com/; PackageVersion: 4073272/C, 02/2004; ComponentLink3URL: http://www.ti.com/lit/ml/mpds035b/mpds035b.pdf; PackageDescription: 10-Pin Plastic Small Outline, Body 3 x 3 mm, Pitch 0.5 mm; Eco-Plan: Green (RoHS & no Sb/Br); ComponentLink1Description: Manufacturer URL; Mounting Technology: Surface Mount; PartNumber: PGA113AIDGSR; DatasheetVersion: SBOS424B